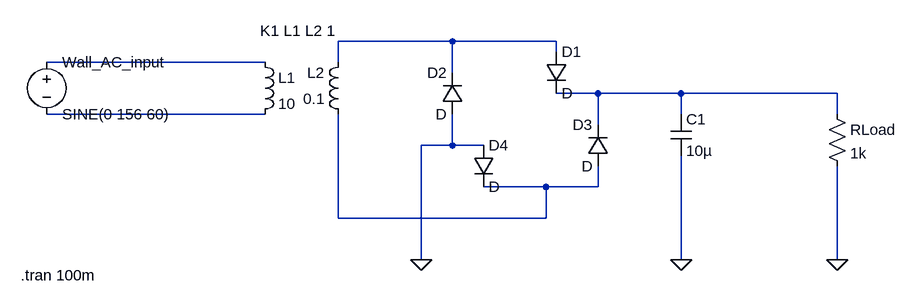
[diagram p0: schematic AC-DC_converter.asc]
AC-DC_converter.asc, the LTspice schematic file:
Version 4.1
SHEET 1 1360 680
WIRE 672 80 496 80
WIRE 832 80 672 80
WIRE 832 96 832 80
WIRE 384 112 48 112
WIRE 496 112 496 80
WIRE 672 128 672 80
WIRE 896 160 832 160
WIRE 1024 160 896 160
WIRE 1264 160 1024 160
WIRE 384 192 48 192
WIRE 1024 192 1024 160
WIRE 1264 192 1264 160
WIRE 896 208 896 160
WIRE 672 240 672 192
WIRE 672 240 624 240
WIRE 720 240 672 240
WIRE 816 304 720 304
WIRE 896 304 896 272
WIRE 896 304 816 304
WIRE 496 352 496 192
WIRE 816 352 816 304
WIRE 816 352 496 352
WIRE 624 416 624 240
WIRE 1024 416 1024 256
WIRE 1264 416 1264 272
FLAG 1024 416 0
FLAG 624 416 0
FLAG 1264 416 0
SYMBOL voltage 48 96 R0
WINDOW 123 0 0 Left 0
WINDOW 39 0 0 Left 0
SYMATTR InstName Wall_AC_input
SYMATTR Value SINE(0 156 60)
SYMBOL ind 368 96 R0
SYMATTR InstName L1
SYMATTR Value 10
SYMATTR Type ind
SYMATTR SpiceLine Rser=1m
SYMBOL ind 512 208 R180
WINDOW 0 36 80 Left 2
WINDOW 3 36 40 Left 2
SYMATTR InstName L2
SYMATTR Value 0.1
SYMATTR Type ind
SYMATTR SpiceLine Rser=1m
SYMBOL diode 816 96 R0
SYMATTR InstName D1
SYMBOL diode 688 192 R180
WINDOW 0 24 64 Left 2
WINDOW 3 24 0 Left 2
SYMATTR InstName D2
SYMBOL diode 912 272 R180
WINDOW 0 24 64 Left 2
WINDOW 3 24 0 Left 2
SYMATTR InstName D3
SYMBOL diode 704 240 R0
SYMATTR InstName D4
SYMBOL cap 1008 192 R0
SYMATTR InstName C1
SYMATTR Value 10µ
SYMBOL res 1248 176 R0
SYMATTR InstName RLoad
SYMATTR Value 1k
TEXT 376 64 Left 2 !K1 L1 L2 1
TEXT 8 440 Left 2 !.tran 100m

The netlist it stands for:
* AC-DC_converter.asc
V§Wall_AC_input N002 N004 SINE(0 156 60)
L1 N002 N004 10 Rser=1m
L2 N005 N001 0.1 Rser=1m
D1 N001 N003 D
D2 0 N001 D
D3 N005 N003 D
D4 0 N005 D
C1 N003 0 10µ
RLoad N003 0 1k
.model D D
.lib standard.dio
K1 L1 L2 1
.tran 100m
.backanno
.end